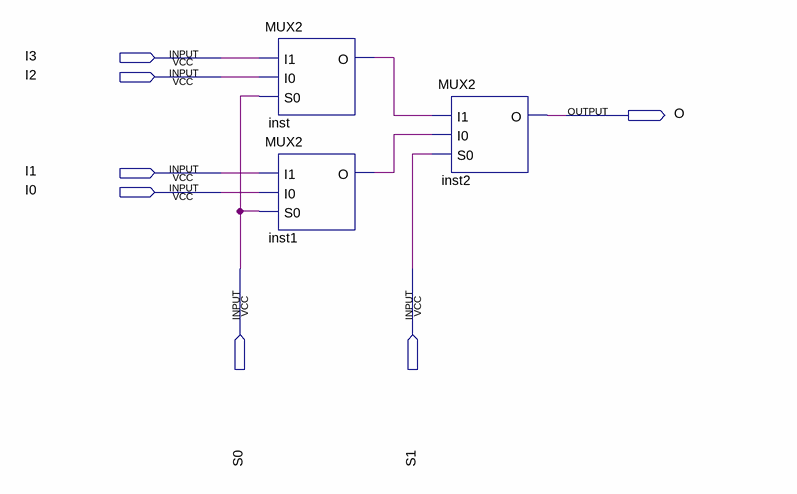
[diagram p0: schematic sheet]
// Quartus schematic MUX4.bdf as structural Verilog: 3 symbols, 7 pins
module MUX4 (
  input  I3,
  input  I2,
  input  I1,
  input  I0,
  input  S0,
  input  S1,
  output O
);

  wire inst1_o, inst_o;

  MUX2 inst (.I1(I3), .I0(I2), .S0(S0), .O(inst_o));
  MUX2 inst1 (.I1(I1), .I0(I0), .S0(S0), .O(inst1_o));
  MUX2 inst2 (.I1(inst_o), .I0(inst1_o), .S0(S1), .O(O));
endmodule
